# Altium project Rigid_Flex_Design.PrjPcb
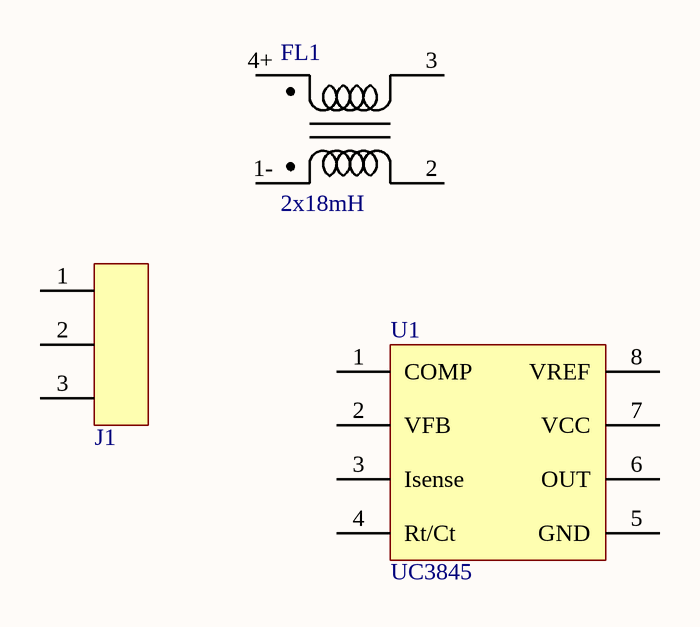
[diagram p0: Rigid_Flex.SchDoc]
1 sheet, 3 parts. Net scope: global (net labels, ports and power ports of the same name join across sheets).
Board file: trial.PcbDoc

## Sheet Rigid_Flex.SchDoc
size A4; SheetNumber: 1; SheetTotal: 1

### Parts
FL1  2x18mH  [2x18mH]
J1  HEADER x3  [HEADER X3]  (value not drawn)
U1  UC3845  [8-DIP]

### Nets

Not connected (* = marked no-connect by the designer): FL1 1-(1) 2 3(2) 4+; J1 1 2 3; U1 1(COMP) 2(VFB) 3(Isense) 4(Rt/Ct) 5(GND) 6(OUT) 7(VCC) 8(VREF)

### Library data of the parts
FL1 = EMI Filter: 2x18mH choke
U1 = UC3845: Boost, Flyback Regulator Positive, Isolation Capable Output Step-Up/Step-Down  DC-DC Controller IC 8-Mini DIP; Manufacturer: STMicroelectronics; Manufacturer Part Number: UC3845BN; Supplier 1: Digikey; RoHS: Yes; Category: Voltage Regulators - Switching; Stock 1: 2211; Pricing 1: 1=0,99, 10=0,889, 50=0,8438, 100=0,6932, 250=0,64796, 500=0,57262, 1000=0,45208, 2500=0,42194, 5000=0,40084 (USD); ComponentLink1URL: https://datasheet.ciiva.com/15108/getdatasheetpartid-31655-15108079.pdf?src-supplier=Verical; ComponentLink1Description: https://datasheet.ciiva.com/15108/getdatasheetpartid-31655-15108079.pdf?src-supplier=Verical; ComponentLink2URL: https://datasheet.ciiva.com/16394/cd00000966-16394470.pdf?src-supplier=Future+Electronics; ComponentLink2Description: https://datasheet.ciiva.com/16394/cd00000966-16394470.pdf?src-supplier=Future+Electronics; ComponentLink3URL: https://datasheet.ciiva.com/4875/cd00000966-4875756.pdf?src-supplier=Mouser; ComponentLink3Description: https://datasheet.ciiva.com/4875/cd00000966-4875756.pdf?src-supplier=Mouser; ComponentLink4URL: https://datasheet.ciiva.com/45260/cd00000966-45260200.pdf?src-supplier=Digikey; ComponentLink4Description: https://datasheet.ciiva.com/45260/cd00000966-45260200.pdf?src-supplier=Digikey; ComponentLink5URL: https://datasheet.ciiva.com/1513/1696818-1513208.pdf?src-supplier=Element14; ComponentLink5Description: https://datasheet.ciiva.com/1513/1696818-1513208.pdf?src-supplier=Element14; Supplier Part Number 1: 497-14808-5-ND